# EAGLE design mixer2x3 (EAGLE 6.6.0)
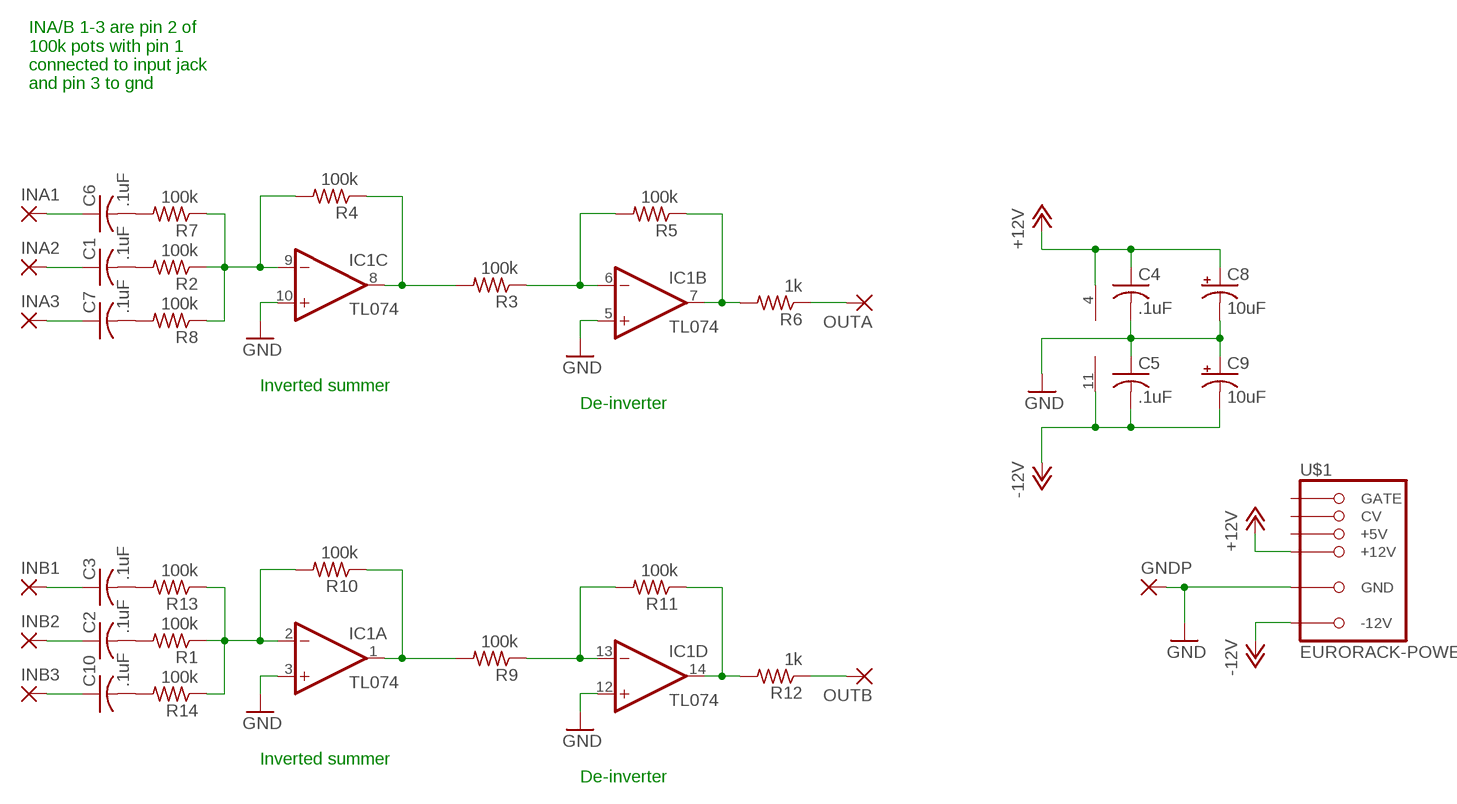
[diagram p0: schematic, sheet 1]

## Parts
C1  .1uF  C-US050-025X075  [C050-025X075]
C2  .1uF  C-US050-025X075  [C050-025X075]
C3  .1uF  C-US050-025X075  [C050-025X075]
C4  .1uF  C-US050-025X075  [C050-025X075]
C5  .1uF  C-US050-025X075  [C050-025X075]
C6  .1uF  C-US050-025X075  [C050-025X075]
C7  .1uF  C-US050-025X075  [C050-025X075]
C8  10uF  CPOL-USE2.5-5  [E2,5-5]
C9  10uF  CPOL-USE2.5-5  [E2,5-5]
C10  .1uF  C-US050-025X075  [C050-025X075]
GNDP  2,54/1,0  [2,54/1,0]
IC1  TL074  TL074-TOPP  [DIL14]
INA1  2,54/1,0  [2,54/1,0]
INA2  2,54/1,0  [2,54/1,0]
INA3  2,54/1,0  [2,54/1,0]
INB1  2,54/1,0  [2,54/1,0]
INB2  2,54/1,0  [2,54/1,0]
INB3  2,54/1,0  [2,54/1,0]
OUTA  2,54/1,0  [2,54/1,0]
OUTB  2,54/1,0  [2,54/1,0]
R1  100k  R-US_0207/10  [0207/10]
R2  100k  R-US_0207/10  [0207/10]
R3  100k  R-US_0207/10  [0207/10]
R4  100k  R-US_0207/10  [0207/10]
R5  100k  R-US_0207/10  [0207/10]
R6  1k  R-US_0207/10  [0207/10]
R7  100k  R-US_0207/10  [0207/10]
R8  100k  R-US_0207/10  [0207/10]
R9  100k  R-US_0207/10  [0207/10]
R10  100k  R-US_0207/10  [0207/10]
R11  100k  R-US_0207/10  [0207/10]
R12  1k  R-US_0207/10  [0207/10]
R13  100k  R-US_0207/10  [0207/10]
R14  100k  R-US_0207/10  [0207/10]
U$1  EURORACK-POWER  [PINSHRD_PTH_2X8]

## Nets
+12V: C4.1 C8.+ IC1.4(P:V+) U$1.+12V@1(+12V) U$1.+12V@2(+12V)
-12V: C5.2 C9.- IC1.11(P:V-) U$1.-12V@1(-12V) U$1.-12V@2(-12V)
GND: C4.2 C5.1 C8.- C9.+ GNDP.1(P) IC1.3(A:+IN) IC1.5(B:+IN) IC1.10(C:+IN) IC1.12(D:+IN) U$1.GND@1(GND) U$1.GND@2(GND) U$1.GND@3(GND) U$1.GND@4(GND) U$1.GND@5(GND) U$1.GND@6(GND)
N$1: IC1.7(B:OUT) R5.1 R6.2
N$2: IC1.9(C:-IN) R2.1 R4.2 R7.1 R8.1
N$3: IC1.8(C:OUT) R3.2 R4.1
N$4: IC1.6(B:-IN) R3.1 R5.2
N$5: C1.2 R2.2
N$6: OUTA.1(P) R6.1
N$7: C6.1 INA1.1(P)
N$8: C6.2 R7.2
N$9: C1.1 INA2.1(P)
N$10: C7.2 R8.2
N$11: C7.1 INA3.1(P)
N$12: IC1.14(D:OUT) R11.1 R12.2
N$13: IC1.2(A:-IN) R1.1 R10.2 R13.1 R14.1
N$14: IC1.1(A:OUT) R9.2 R10.1
N$15: IC1.13(D:-IN) R9.1 R11.2
N$16: C2.2 R1.2
N$17: OUTB.1(P) R12.1
N$18: C3.2 R13.2
N$19: C10.2 R14.2
N$20: C3.1 INB1.1(P)
N$21: C2.1 INB2.1(P)
N$22: C10.1 INB3.1(P)
Unconnected: U$1.+5V@1(+5V) U$1.+5V@2(+5V) U$1.CV@1(CV) U$1.CV@2(CV) U$1.GATE@1(GATE) U$1.GATE@2(GATE)

## Notes on the sheet
- INA/B 1-3 are pin 2 of 
  100k pots with pin 1
  connected to input jack
  and pin 3 to gnd
- Inverted summer
- De-inverter
- Inverted summer
- De-inverter

## Library data of the parts
C1-C7 C10 = rcl:C-US: CAPACITOR, American symbol
C8 C9 = rcl:CPOL-US: POLARIZED CAPACITOR, American symbol
GNDP INA1-INA3 INB1-INB3 OUTA OUTB = wirepad:2,54/1,0: THROUGH-HOLE PAD
IC1 = mmoretti:TL074-TOP: OP AMP
R1-R14 = rcl:R-US_: RESISTOR, American symbol
U$1 = mmoretti:EURORACK-POWER

## Board
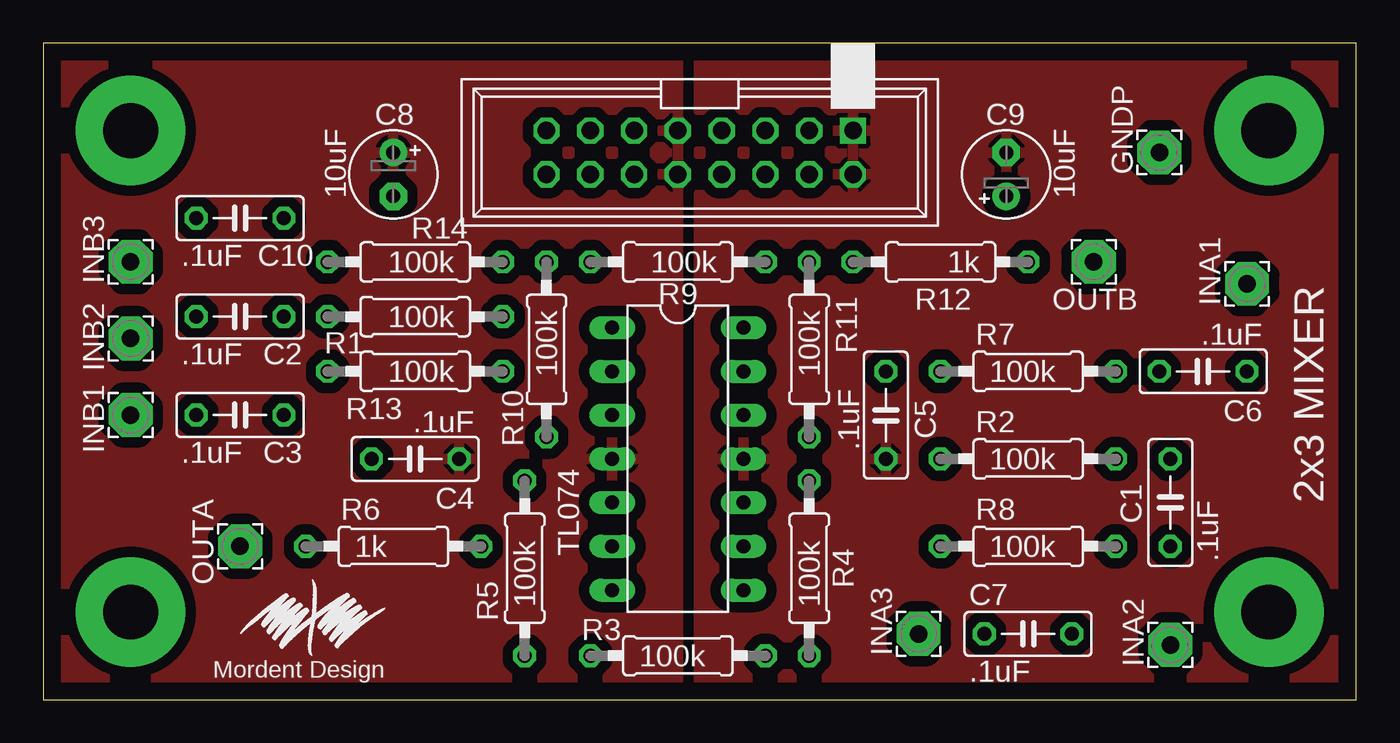
[diagram p1: board, top side]
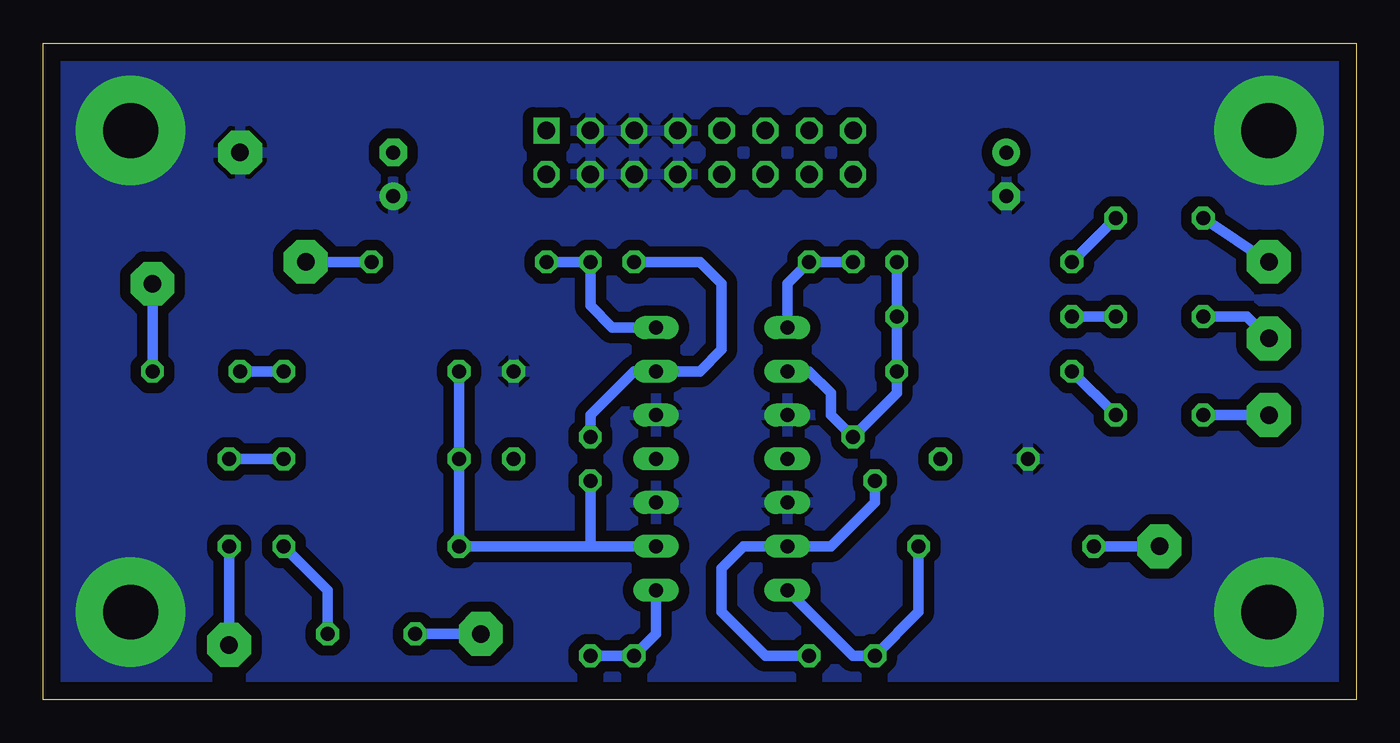
[diagram p2: board, bottom side, seen from below]

Size 76.2 x 38.1 mm. Coordinates in mm from the lower left corner, seen from the top.
Outline: 76.2,0 76.2,38.08 0,38.1 0,0 76.2,0
Copper layers (1*16): Top 0.035mm / dielectric 1.5mm / Bottom 0.035mm
Design rules "default": minimum track width 10mil, minimum drill 24mil, track to track 8mil, track to pad 8mil, pad to pad 8mil, via to via 8mil, smd to smd 8mil, copper to edge 40mil, drill to drill 8mil, minimum pad ring 10mil, minimum via ring 8mil, stop-mask expansion 4mil, vias tented up to drill 0mil, thermal gap 10mil

### Footprints (pad centres in the part's own frame; a part is rotated, then mirrored left to right if it is on the bottom)
C050-025X075 = drill 0.813 octagon: 1 -2.54,0; 2 2.54,0
E2,5-5 = drill 0.813 pad 1.6: + -1.27,0 | drill 0.813 pad 1.6 octagon: - 1.27,0
2,54/1,0 = drill 1.016 pad 2.54 octagon: 1 0,0
DIL14 = drill 0.813 long: 1 -7.62,-3.81; 2 -5.08,-3.81; 3 -2.54,-3.81; 4 0,-3.81; 5 2.54,-3.81; 6 5.08,-3.81; 7 7.62,-3.81; 8 7.62,3.81; 9 5.08,3.81; 10 2.54,3.81; 11 0,3.81; 12 -2.54,3.81; 13 -5.08,3.81; 14 -7.62,3.81
0207/10 = drill 0.813 octagon: 1 -5.08,0; 2 5.08,0
PINSHRD_PTH_2X8 = drill 1.016 octagon: +5V@1 3.81,1.27; +5V@2 3.81,-1.27; +12V@1 1.27,1.27; +12V@2 1.27,-1.27; -12V@1 -8.89,1.27; CV@1 6.35,1.27; CV@2 6.35,-1.27; GATE@1 8.89,1.27; GATE@2 8.89,-1.27; GND@1 -6.35,1.27; GND@2 -6.35,-1.27; GND@3 -3.81,1.27; GND@4 -3.81,-1.27; GND@5 -1.27,1.27; GND@6 -1.27,-1.27 | drill 1.016 square: -12V@2 -8.89,-1.27

### Placement (x,y rotation side)
C1  65.41,11.43 90 top
C2  11.43,22.23 0 top
C3  11.43,16.51 0 top
C4  21.59,13.97 180 top
C5  48.9,16.51 270 top
C6  67.31,19.05 180 top
C7  57.15,3.81 0 top
C8  20.32,30.48 270 top
C9  55.88,30.48 90 top
C10  11.43,27.94 0 top
GNDP  64.77,31.75 90 top
IC1  36.83,13.97 270 top
INA1  69.85,24.13 90 top
INA2  65.41,3.17 90 top
INA3  50.8,3.81 90 top
INB1  5.08,16.51 90 top
INB2  5.08,20.95 90 top
INB3  5.08,25.4 90 top
OUTA  11.43,8.89 90 top
OUTB  60.96,25.4 90 top
R1  21.59,22.23 180 top
R2  57.15,13.97 0 top
R3  36.83,2.54 0 top
R4  44.45,7.62 90 top
R5  27.94,7.62 90 top
R6  20.32,8.89 0 top
R7  57.15,19.05 0 top
R8  57.15,8.89 0 top
R9  36.83,25.4 180 top
R10  29.21,20.32 270 top
R11  44.45,20.32 270 top
R12  52.07,25.4 180 top
R13  21.59,19.05 180 top
R14  21.59,25.4 180 top
U$1  38.1,31.75 180 top

### Tracks (layer width: path | path; a pad name or v marks a point on that pad's centre or on a via)
+12V
  pour Top (isolate 0.61): 0,38.1 36.83,38.1 36.83,0 0,0
-12V
  pour Top (isolate 0.61, rank 2): 36.83,38.1 76.2,38.1 76.2,0 36.83,0
GND  (via drill 3.17 pad 6.35)
  other vias: 71.12,5.08 5.08,5.08 5.08,33.02 71.12,33.02
  pour Bottom (isolate 0.61): 0,38.1 76.2,38.1 76.2,0 0,0
N$1
  Bottom 0.61: R6.2 25.4,5.08 R5.1 29.21,2.54 IC1.7
N$2
  Bottom 0.61: 44.45,8.89 R8.1 R2.1 R7.1 | 44.45,8.89 IC1.9 | R4.2 44.45,8.89
N$3
  Bottom 0.61: IC1.8 40.64,3.81 R3.2 R4.1
N$4
  Bottom 0.61: R3.1 34.29,2.54 36.83,5.08 36.83,7.62 35.56,8.89 IC1.6 30.48,8.89 27.94,11.43 R5.2
N$5
  Bottom 0.61: C1.2 R2.2
N$6
  Bottom 0.61: OUTA.1 R6.1
N$7
  Bottom 0.61: C6.1 INA1.1
N$8
  Bottom 0.61: R7.2 C6.2
N$9
  Bottom 0.61: INA2.1 C1.1
N$10
  Bottom 0.61: C7.2 59.69,6.35 R8.2
N$11
  Bottom 0.61: INA3.1 C7.1
N$12
  Bottom 0.61: R12.2 R11.1 44.45,22.86 43.18,21.59 IC1.14
N$13
  Bottom 0.61: R14.1 R1.1 R13.1 26.67,17.78 R10.2 30.48,16.51 30.48,17.78 31.75,19.05 IC1.2
N$14
  Bottom 0.61: IC1.1 33.02,24.13 R9.2 R10.1
N$15
  Bottom 0.61: R11.2 44.45,16.51 41.91,19.05 IC1.13 38.1,19.05 36.83,20.32 36.83,24.13 38.1,25.4 R9.1
N$16
  Bottom 0.61: C2.2 R1.2
N$17
  Bottom 0.61: OUTB.1 R12.1
N$18
  Bottom 0.61: C3.2 R13.2
N$19
  Bottom 0.61: C10.2 R14.2
N$20
  Bottom 0.61: INB1.1 C3.1
N$21
  Bottom 0.61: INB2.1 6.35,22.23 C2.1
N$22
  Bottom 0.61: INB3.1 C10.1

### Text on the board
tPlace: 2x3 MIXER | Mordent Design